# Altium schematic sheet #NIP涡轮驱动板-MCUnew.SchDoc
size A3
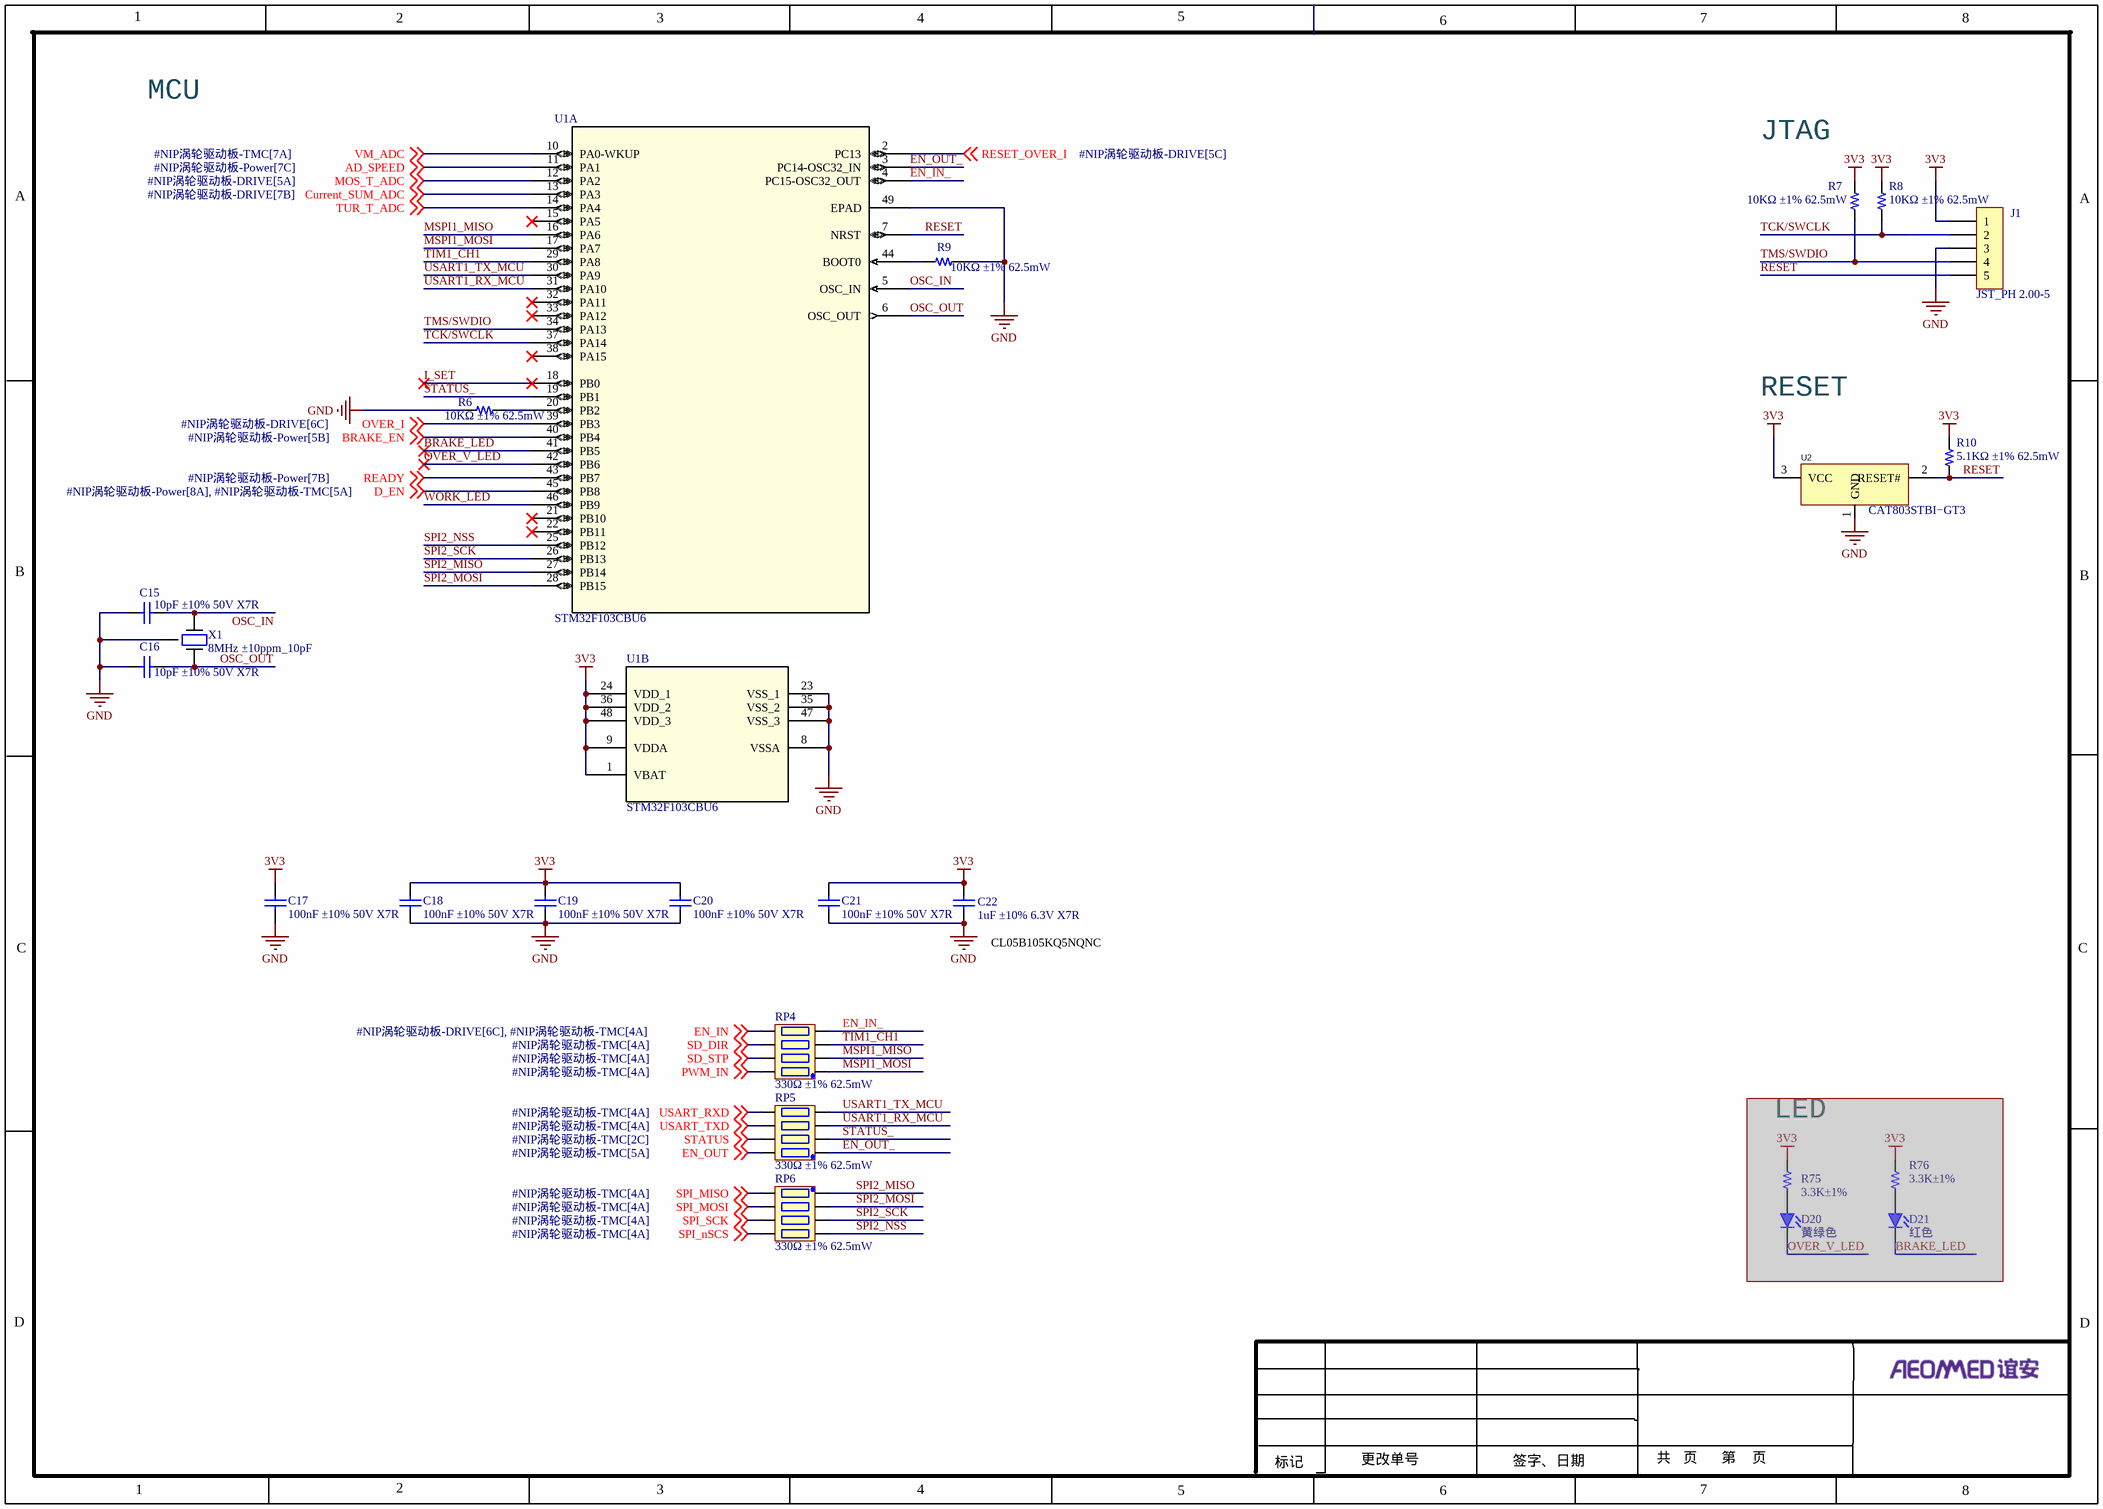
[diagram p0: #NIP涡轮驱动板-MCUnew.SchDoc]

## Parts
C15  10pF ±10% 50V X7R  [C0402]
C16  10pF ±10% 50V X7R  [C0402]
C17  100nF ±10% 50V X7R  [C0402]
C18  100nF ±10% 50V X7R  [C0402]
C19  100nF ±10% 50V X7R  [C0402]
C20  100nF ±10% 50V X7R  [C0402]
C21  100nF ±10% 50V X7R  [C0402]
C22  1uF ±10% 6.3V X7R  [C0402]
D20  黄绿色  [LED-0805]  (masked out: inside a compile mask, not in the netlist)
D21  红色  [LED-0805]  (masked out: inside a compile mask, not in the netlist)
J1  JST_PH 2.00-5  [JST_PH 2.00-5]
R6  10KΩ ±1% 62.5mW  [R0402]
R7  10KΩ ±1% 62.5mW  [R0402]
R8  10KΩ ±1% 62.5mW  [R0402]
R9  10KΩ ±1% 62.5mW  [R0402]
R10  5.1KΩ ±1% 62.5mW  [R0402]
R75  3.3K±1%  [R-0603]  (masked out: inside a compile mask, not in the netlist)
R76  3.3K±1%  [R-0603]  (masked out: inside a compile mask, not in the netlist)
RP4  330Ω ±1% 62.5mW  [RES-ARRAY-SMD_0402-8P-L2.0-W1.0-BL]
RP5  330Ω ±1% 62.5mW  [RES-ARRAY-SMD_0402-8P-L2.0-W1.0-BL]
RP6  330Ω ±1% 62.5mW  [RES-ARRAY-SMD_0402-8P-L2.0-W1.0-BL]
U1  STM32F103CBU6  [UFQFPN-48_7X7X0P55MM]  (parts A,B of 2)
U2  CAT803STBI−GT3  [SOT-23-3_L2.9-W1.3-P1.90-LS2.4-BR]
X1  8MHz ±10ppm_10pF  [CRYSTAL_3225]

## Nets
3V3: C17.1 C18.1 C19.2 C20.2 C21.1 C22.2 J1.1 R7.2 R8.2 R10.2 U1.1(VBAT) U1.9(VDDA) U1.24(VDD_1) U1.36(VDD_2) U1.48(VDD_3) U2.3(VCC)
GND: C15.2 C16.2 C17.2 C18.2 C19.1 C20.1 C21.2 C22.1 J1.3 R6.2 R9.2 U1.8(VSSA) U1.23(VSS_1) U1.35(VSS_2) U1.47(VSS_3) U1.49(EPAD) U2.1(GND) X1.G
AD_SPEED: U1.11(PA1) ; off-sheet AD_SPEED
BRAKE_EN: U1.40(PB4) ; off-sheet BRAKE_EN
BRAKE_LED: U1.41(PB5)
Current_SUM_ADC: U1.13(PA3) ; off-sheet Current_SUM_ADC
D_EN: U1.45(PB8) ; off-sheet D_EN
EN_IN: RP4.5 ; off-sheet EN_IN
EN_IN_: RP4.4 U1.4(PC15-OSC32_OUT)
EN_OUT: RP5.8 ; off-sheet EN_OUT
EN_OUT_: RP5.1 U1.3(PC14-OSC32_IN)
I_SET: U1.18(PB0)
MOS_T_ADC: U1.12(PA2) ; off-sheet MOS_T_ADC
MSPI1_MISO: RP4.2 U1.16(PA6)
MSPI1_MOSI: RP4.1 U1.17(PA7)
OSC_IN: C15.1 U1.5(OSC_IN) X1.1
OSC_OUT: C16.1 U1.6(OSC_OUT) X1.3
OVER_I: U1.39(PB3) ; off-sheet OVER_I
OVER_V_LED: U1.42(PB6)
PWM_IN: RP4.8 ; off-sheet PWM_IN
READY: U1.43(PB7) ; off-sheet READY
RESET: J1.5 R10.1 U1.7(NRST) U2.2(RESET#)
RESET_OVER_I: U1.2(PC13) ; off-sheet RESET_OVER_I
SD_DIR: RP4.6 ; off-sheet SD_DIR
SD_STP: RP4.7 ; off-sheet SD_STP
SPI2_MISO: RP6.1 U1.27(PB14)
SPI2_MOSI: RP6.2 U1.28(PB15)
SPI2_NSS: RP6.4 U1.25(PB12)
SPI2_SCK: RP6.3 U1.26(PB13)
SPI_MISO: RP6.8 ; off-sheet SPI_MISO
SPI_MOSI: RP6.7 ; off-sheet SPI_MOSI
SPI_nSCS: RP6.5 ; off-sheet SPI_nSCS
SPI_SCK: RP6.6 ; off-sheet SPI_SCK
STATUS: RP5.7 ; off-sheet STATUS
STATUS_: RP5.2 U1.19(PB1)
TCK/SWCLK: J1.2 R8.1 U1.37(PA14)
TIM1_CH1: RP4.3 U1.29(PA8)
TMS/SWDIO: J1.4 R7.1 U1.34(PA13)
TUR_T_ADC: U1.14(PA4) ; off-sheet TUR_T_ADC
USART1_RX_MCU: RP5.3 U1.31(PA10)
USART1_TX_MCU: RP5.4 U1.30(PA9)
USART_RXD: RP5.5 ; off-sheet USART_RXD
USART_TXD: RP5.6 ; off-sheet USART_TXD
VM_ADC: U1.10(PA0-WKUP) ; off-sheet VM_ADC
WORK_LED: U1.46(PB9)
NetR6_1: R6.1 U1.20(PB2)
NetR9_1: R9.1 U1.44(BOOT0)

Not connected (* = marked no-connect by the designer): U1 15(PA5)* 21(PB10)* 22(PB11)* 32(PA11)* 33(PA12)* 38(PA15)*

## Notes on the sheet
- MCU
- JTAG
- RESET
- (near C22) CL05B105KQ5NQNC
- (near R75) LED
- 1
- 2
- 3
- 4
- 5
- 6
- 7
- 8
- A
- B
- C
- D
- 更改单号
- 共   页      第    页
- 标记
- 签字、日期

## Library data of the parts
C15-C21 = Cap: Capacitor; Published: 8-Jun-2000; LatestRevisionDate: 17-Jul-2002; LatestRevisionNote: Re-released for DXP Platform.; PackageReference: RAD-0.3; Publisher: Altium Limited; PackageDescription: Radial Cap, Thru-Hole; 2 Leads; 0.3 in Pin Spacing
C22 = Cap: CL05B105KQ5NQNC; Published: 8-Jun-2000; LatestRevisionDate: 17-Jul-2002; LatestRevisionNote: Re-released for DXP Platform.; PackageReference: RAD-0.3; Publisher: Altium Limited; PackageDescription: Radial Cap, Thru-Hole; 2 Leads; 0.3 in Pin Spacing
D20 = LED-0805: 品牌:Everlight（亿光），型号17-21SYGC/S530-E2/TR8，Typ.23mcd@20mA，ROHS
D21 = LED-0805: 品牌:Everlight（亿光），型号:17-21SURC/S530-A3/TR8，Typ.61mcd@20mA, ROHS
J1 = JST_PH 2.00-5: 品牌：JST 型号：B5B-PH-K-S，直插，间距2.00，5pin; 名称: 插座2针，2.0间距; 制造商: JST; 物料编号: B5B-PH-K-S
R6-R10 R75 R76 = R-0603
RP4-RP6 = RP-0603
U1 = STM32F103CBU6: Mfr_Name: STMicroelectronics; RefDes: RefDes; Type: Type
U2 = CAT8xxxxxI-(G)T3: 3-Pin Microprocessor Power Supply Supervisors / − CAT803: Open−Drain Active LOW Reset / − CAT809: Push−Pull Active LOW Reset / − CAT810: Push−Pull Active HIGH Reset; Manufacturer: TI(德州仪器); Name: TLV70015DDCR; Add into BOM: yes; Output Type: 固定; Output Polarity: 正; Number of Outputs: 1; Maximum Input Voltage: 5.5V; Output Voltage: 1.5V; Dropout Voltage: 250mV@(200mA); Quiescent Current (Ground Current): 55uA; Output Current: 200mA; Power Supply Rejection Ratio (PSRR): 68dB@(1kHz); Symbol: TLV70015DDCR; Device: TLV70015DDCR; LCSC Part Name: TLV70015DDCR; Supplier Part: C2865100; Manufacturer Part: TLV70015DDCR; Supplier Footprint: SOT-23-Thin-5; JLCPCB Part Class: Extended Part; Datasheet: https://atta.szlcsc.com/upload/public/pdf/source/20230221/CBA3FAF2ECD8317094AE1D26AA0CA23B.pdf; Supplier: LCSC; Convert to PCB: yes; Operating Temperature: -40℃~+125℃@(Tj)
X1 = CRYSTAL: Crystal 8MHz ±10ppm 10pF 200 Ohm -10°C ~ 60°C Surface Mount 4-SMD, No Lead (DFN, LCC); Manufacturer: Abracon LLC; Manufacturer Part Number: ABM3B-8.000MHZ-10-1-U-T; Operating Mode: Fundamental; Supplier 1: Digi-Key; Supplier Part Number 1: 535-9721-1-ND; RoHS: RoHS Compliant; Category: Crystals, Oscillators, Resonators; Stock: 35437; Pricing 1: 1=0.69, 10=0.578, 50=0.5198, 100=0.462, 500=0.4389 (USD); Packaging: Cut Tape (CT); Part Status: Active; Type: MHz Crystal; Frequency Stability: ±10ppm; Frequency Tolerance: ±10ppm; Load Capacitance: 10pF; Operating Temperature: -10°C ~ 60°C; Ratings: -; Mounting Type: Surface Mount; Package / Case: 4-SMD, No Lead; Size / Dimension: 0.197" L x 0.126" W (5.00mm x 3.20mm); Height - Seated (Max): 0.043" (1.10mm); ComponentLink1URL: http://www.abracon.com/Resonators/abm3b.pdf; ComponentLink1Description: http://www.abracon.com/Resonators/abm3b.pdf; Supplier 2: Digi-Key; Supplier Part Number 2: 535-9721-2-ND; Pricing 2: 1000=0.336, 3000=0.315, 5000=0.3045, 10000=0.294 (USD)